# Altium schematic sheet main.SchDoc
size A; SheetNumber: 1; SheetTotal: 1
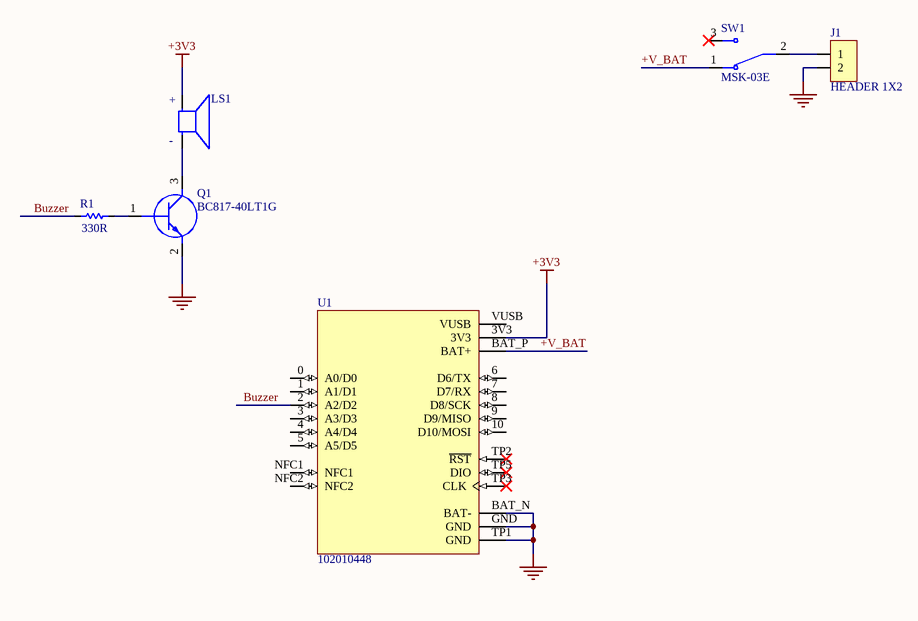
[diagram p0: main.SchDoc]

## Parts
J1  HEADER 1X2  [HEADER 1X2]
LS1  BUZZER  [CMT-8504-100-SMT-TR]  (value not drawn)
Q1  BC817-40LT1G  [BC817-40LT1G]
R1  value 330R  [RES0603]  (hidden comment: Resistor)
SW1  MSK-03E  [MSK-03E]
U1  102010448  [102010448]

## Nets
+3V3: LS1.P U1.3V3
GND: J1.2 Q1.2(E) U1.BAT_N(BAT-) U1.GND U1.TP1(GND)
+V_BAT: SW1.1 U1.BAT_P(BAT+)
Buzzer: R1.2 U1.2(A2/D2)
NetJ1_1: J1.1 SW1.2
NetLS1_N: LS1.N Q1.3(C)
NetQ1_1: Q1.1(B) R1.1

Not connected (* = marked no-connect by the designer): SW1 3*; U1 0(A0/D0) 1(A1/D1) 3(A3/D3) 4(A4/D4) 5(A5/D5) 6(D6/TX) 7(D7/RX) 8(D8/SCK) 9(D9/MISO) 10(D10/MOSI) NFC1 NFC2 TP2(~{RST})* TP3(CLK)* TP5(DIO)* VUSB

## Notes on the sheet
- (in symbol CMT-8504-100-SMT-TR) +; -

## Library data of the parts
J1 = HEADER 1X2: Component Description: CONN HEADER VERT 2POS 2.54MM; manufaturer part number: HEADER 1X2
LS1 = CMT-8504-100-SMT-TR: AUDIO INDICATOR 5VDC 30MA 85DB; Manufacturer: Same Sky (Formerly CUI Devices); MF: {'manufacturer': u'PUI Audio, Inc.'}; MP: AI-1223-TWT-3V-2-R; Component Description: BUZZER MAGNETIC 5V 0.34X0.34 SMD; Package: None; Price: None; Value: *; Availability: Unavailable; manufaturer part number: CMT-8504-100-SMT-TR
Q1 = BC817-40LT1G: Transistor BJT NPN; Manufacturer_Name: Nexperia; Manufacturer_Part_Number: BC817,215; Manufacturer: onsemi; Component Description: TRANS NPN 45V 0.5A SOT23-3; Datasheet Link: https://assets.nexperia.com/documents/data-sheet/BC817_SER.pdf; Height: 1.1mm; Mouser Part Number: 771-BC817-T/R; Mouser Price/Stock: https://www.mouser.co.uk/ProductDetail/Nexperia/BC817215?qs=me8TqzrmIYXz7pTxqNMGNQ%3D%3D; Arrow Part Number: BC817,215; Arrow Price/Stock: https://www.arrow.com/en/products/bc817215/nexperia?utm_currency=USD&region=nac; manufaturer part number: BC817-40LT1G
R1 = CRCW0603330RJNEA: Generic Resistor; Manufacturer: VISHAY DALE; Component Description: RES SMD 330R 5% 1/10W 0603; Manufaturer Part Number: CRCW0603330RJNEA
SW1 = MSK-03E: Component Description: SWITCH 1P2T 2MM; manufaturer part number: MSK-03E; Manufacturer: -
U1 = 102010448: - nRF52840 Transceiver; Bluetooth® 5.x Evaluation Board; MF: Seeed Technology Co., Ltd; Component Description: XIAO NRF52840; SnapEDA_Link: https://www.snapeda.com/parts/102010448/Seeed+Technology+Co.%252C+Ltd/view-part/?ref=snap; Package: None; Value: *; MP: 102010448; Check_prices: https://www.snapeda.com/parts/102010448/Seeed+Technology+Co.%252C+Ltd/view-part/?ref=eda; manufaturer part number: 102010448; Manufacturer: Seeed Technology Co., Ltd